# EAGLE design CMD_Light (EAGLE 7.0.0)
Jason Mraz feat. Colbie Caillat - Lucky Birdy - Wings
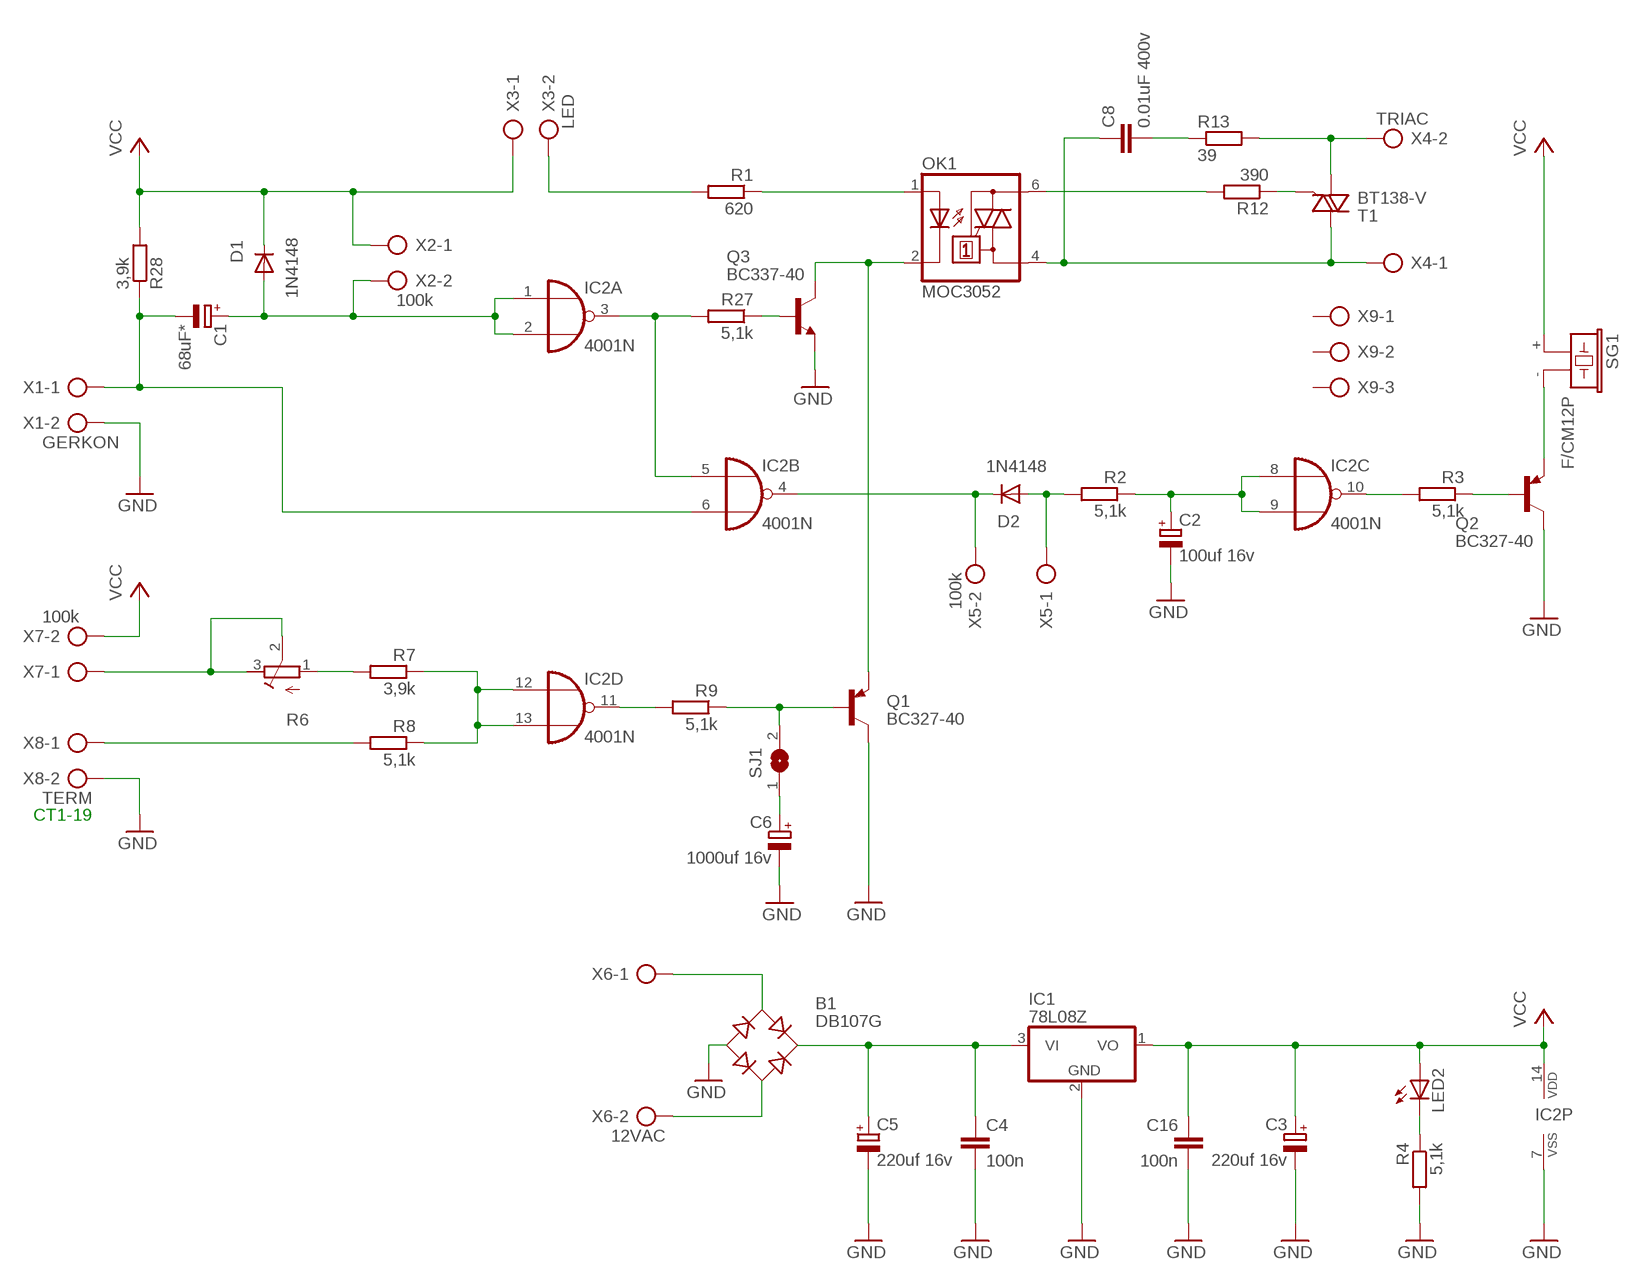
[diagram p0: schematic, sheet 1]

## Parts
B1  DB107G  DBDB107G  [DB]
C1  68uF*  CPOL-EUE3.5-8  [E3,5-8]
C2  100uf 16v  CPOL-EUE3.5-8  [E3,5-8]
C3  220uf 16v  CPOL-EUE3.5-8  [E3,5-8]
C4  100n  C-EU050-035X075  [C050-035X075]
C5  220uf 16v  CPOL-EUE3.5-8  [E3,5-8]
C6  1000uf 16v  CPOL-EUE5-10.5  [E5-10,5]
C8  0.01uF 400v  C-EU075-063X106  [C075-063X106]
C16  100n  C-EU050-035X075  [C050-035X075]
D1  1N4148  1N4004_  [DO41-8]
D2  1N4148  1N4004  [DO41-10]
IC1  78L08Z  [TO92]
IC2  4001N  [DIL14]
LED2  LED3MM  [LED3MM]
OK1  MOC3052  MOC3042M  [DIL06]
Q1  BC327-40  [TO92-EBC]
Q2  BC327-40  [TO92-EBC]
Q3  BC337-40  BC338-40  [TO92-EBC]
R1  620  R-EU_0207/10  [0207/10]
R2  5,1k  R-EU_0207/10  [0207/10]
R3  5,1k  R-EU_0207/10  [0207/10]
R4  5,1k  R-EU_0207/10  [0207/10]
R6  R-TRIMM3339P  [RTRIM3339P]
R7  3,9k  R-EU_0207/10  [0207/10]
R8  5,1k  R-EU_0207/10  [0207/10]
R9  5,1k  R-EU_0207/10  [0207/10]
R12  390  R-EU_0207/10  [0207/10]
R13  39  R-EU_0411/12  [0411/12]
R27  5,1k  R-EU_0207/10  [0207/10]
R28  3,9k  R-EU_0207/12  [0207/12]
SG1  F/CM12P  [F/CM12P]
SJ1  SJ  [SJ]
T1  BT138-V  [TO220BV]
X1  GERKON  AK500/2  [AK500/2]
X2  100k  AK500/2  [AK500/2]
X3  LED  AK500/2  [AK500/2]
X4  TRIAC  AK500/2  [AK500/2]
X5  100k  AK500/2  [AK500/2]
X6  12VAC  AK500/2  [AK500/2]
X7  100k  AK500/2  [AK500/2]
X8  TERM  AK500/2  [AK500/2]
X9  AK500/3  [AK500/3]

## Nets
GND: B1.- C2.- C3.- C4.2 C5.- C6.- C16.2 IC1.2(GND) IC2.7(P:VSS) Q1.C Q2.C Q3.E R4.2 X1.2 X8.2
N$1: Q3.B R27.1
N$2: IC2.3(A:O) IC2.5(B:I0) R27.2
N$3: C1.- IC2.6(B:I1) R28.1 X1.1
N$4: OK1.1(A) R1.1
N$6: OK1.2(C) Q1.E Q3.C
N$7: C6.+ SJ1.1
N$8: R12.1 T1.G
N$9: R1.2 X3.2
N$11: B1.AC2 X6.2
N$12: C2.+ IC2.8(C:I0) IC2.9(C:I1) R2.1
N$13: IC2.10(C:O) R3.2
N$14: Q2.B R3.1
N$15: R13.2 T1.T1(A1) X4.2
N$16: Q2.E SG1.-
N$17: B1.+ C4.1 C5.+ IC1.3(VI)
N$18: D2.A R2.2 X5.1
N$19: C8.2 R13.1
N$20: C1.+ D1.A IC2.1(A:I0) IC2.2(A:I1) X2.2
N$21: IC2.12(D:I0) IC2.13(D:I1) R7.1 R8.1
N$22: LED2.K(C) R4.1
N$23: R6.2(S) R6.3(E) X7.1
N$24: IC2.11(D:O) R9.2
N$27: R6.1(A) R7.2
N$28: R8.2 X8.1
N$34: D2.C IC2.4(B:O) X5.2
N$37: B1.AC1 X6.1
N$38: OK1.6(A2) R12.2
N$39: Q1.B R9.1 SJ1.2
N$41: C8.1 OK1.4(A1) T1.T2(A2) X4.1
VCC: C3.+ C16.1 D1.C IC1.1(VO) IC2.14(P:VDD) LED2.A R28.2 SG1.+ X2.1 X3.1 X7.2
Unconnected: X9.1 X9.2 X9.3

## Notes on the sheet
- CT1-19

## Library data of the parts
B1 = rectifier:DB?*G: Single Phase 1.0 AMP Glass Passivated Bridge Rectifier Taiwan Semiconductor Co.,Ltd. - TSC Source: http://www.taiwansemi.com/TSCbig5/ezcatfiles/cust/img/img/db101g.pdf http://www.ts.com.tw/db/pictures/modules/PDT/PDT060207001/DBLS201G.pdf
C1-C3 C5 C6 = rcl:CPOL-EU: POLARIZED CAPACITOR, European symbol
C4 C8 C16 = rcl:C-EU: CAPACITOR, European symbol
D1 D2 = diode:1N4004: DIODE general purpose rectifier, 1 A
IC1 = linear:78*: Positive VOLTAGE REGULATOR Source: http://cache.national.com/ds/LM/LM78L05.pdf http://www.fairchildsemi.com/ds/LM/LM7805.pdf
IC2 = 40xx:4001: Quad 2-input NOR
LED2 = led:LED: LED OSRAM: - CHIPLED LG R971, LG N971, LY N971, LG Q971, LY Q971, LO R971, LY R971 LH N974, LH R974 LS Q976, LO Q976, LY Q976 LO Q996 - Hyper CHIPLED LW Q18S LB Q993, LB Q99A, LB R99A - SideLED LS A670, LO A670, LY A670, LG A670, LP A670 LB A673, LV A673, LT A673, LW A673 LH A674 LY A675 LS A676, LA A676, LO A676, LY A676, LW A676 LS A679, LY A679, LG A679 - Hyper Micro SIDELED® LS Y876, LA Y876, LO Y876, LY Y876 LT Y87S - SmartLED LW L88C, LW L88S LB L89C, LB L89S, LG L890 LS L89K, LO L89K, LY L89K LS L896, LA L896, LO L896, LY L896 - TOPLED LS T670, LO T670, LY T670, LG T670, LP T670 LSG T670, LSP T670, LSY T670, LOP T670, LYG T670 LG T671, LOG T671, LSG T671 LB T673, LV T673, LT T673, LW T673 LH T674 LS T676, LA T676, LO T676, LY T676, LB T676, LH T676, LSB T676, LW T676 LB T67C, LV T67C, LT T67C, LS T67K, LO T67K, LY T67K, LW E67C LS E67B, LA E67B, LO E67B, LY E67B, LB E67C, LV E67C, LT E67C LW T67C LS T679, LY T679, LG T679 LS T770, LO T770, LY T770, LG T770, LP T770 LB T773, LV T773, LT T773, LW T773 LH T774 LS E675, LA E675, LY E675, LS T675 LS T776, LA T776, LO T776, LY T776, LB T776 LHGB T686 LT T68C, LB T68C - Hyper Mini TOPLED® LB M676 - Mini TOPLED Santana® LG M470 LS M47K, LO M47K, LY M47K Source: http://www.osram.convergy.de LUXEON: - LUMILED® LXK2-PW12-R00, LXK2-PW12-S00, LXK2-PW14-U00, LXK2-PW14-V00 LXK2-PM12-R00, LXK2-PM12-S00, LXK2-PM14-U00 LXK2-PE12-Q00, LXK2-PE12-R00, LXK2-PE12-S00, LXK2-PE14-T00, LXK2-PE14-U00 LXK2-PB12-K00, LXK2-PB12-L00, LXK2-PB12-M00, LXK2-PB14-N00, LXK2-PB14-P00, LXK2-PB14-Q00 LXK2-PR12-L00, LXK2-PR12-M00, LXK2-PR14-Q00, LXK2-PR14-R00 LXK2-PD12-Q00, LXK2-PD12-R00, LXK2-PD12-S00 LXK2-PH12-R00, LXK2-PH12-S00 LXK2-PL12-P00, LXK2-PL12-Q00, LXK2-PL12-R00 Source: www.luxeon.com KINGBRIGHT: KA-3528ASYC Source: www.kingbright.com
OK1 = optocoupler:MOC30*: 6-Pin DIP Zero-Cross Optoisolators Triac Driver Output (250/400 Volt Peak) Source: Data sheet <http://www.fairchildsemi.com/ds/MO/MOC3031M.pdf> The old path of data sheet not more available 2013-05-06.; MF: FAIRCHILD SEMICONDUCTOR; MPN: MOC3042-M; OC_FARNELL: 1021368; OC_NEWARK: 72K8899
Q1 Q2 = transistor-pnp:BC327*: PNP Transistror
Q3 = transistor-npn:BC338*: NPN Transistor
R1-R4 R7-R9 R12 R13 R27 R28 = rcl:R-EU_: RESISTOR, European symbol
R6 = rcl:R-TRIMM: Trimm resistor
SG1 = buzzer:F/CM12P: BUZZER Source: Buerklin; OC_FARNELL: unknown; OC_NEWARK: unknown
SJ1 = jumper:SJ: SMD solder JUMPER
T1 = triac:BT138: TRIAC Source: http://www.semiconductors.philips.com BT138_SERIES_2.pdf
X1-X8 = con-ptr500:AK500/2: CONNECTOR; OC_FARNELL: unknown; OC_NEWARK: unknown
X9 = con-ptr500:AK500/3: CONNECTOR; OC_FARNELL: unknown; OC_NEWARK: unknown

## Board
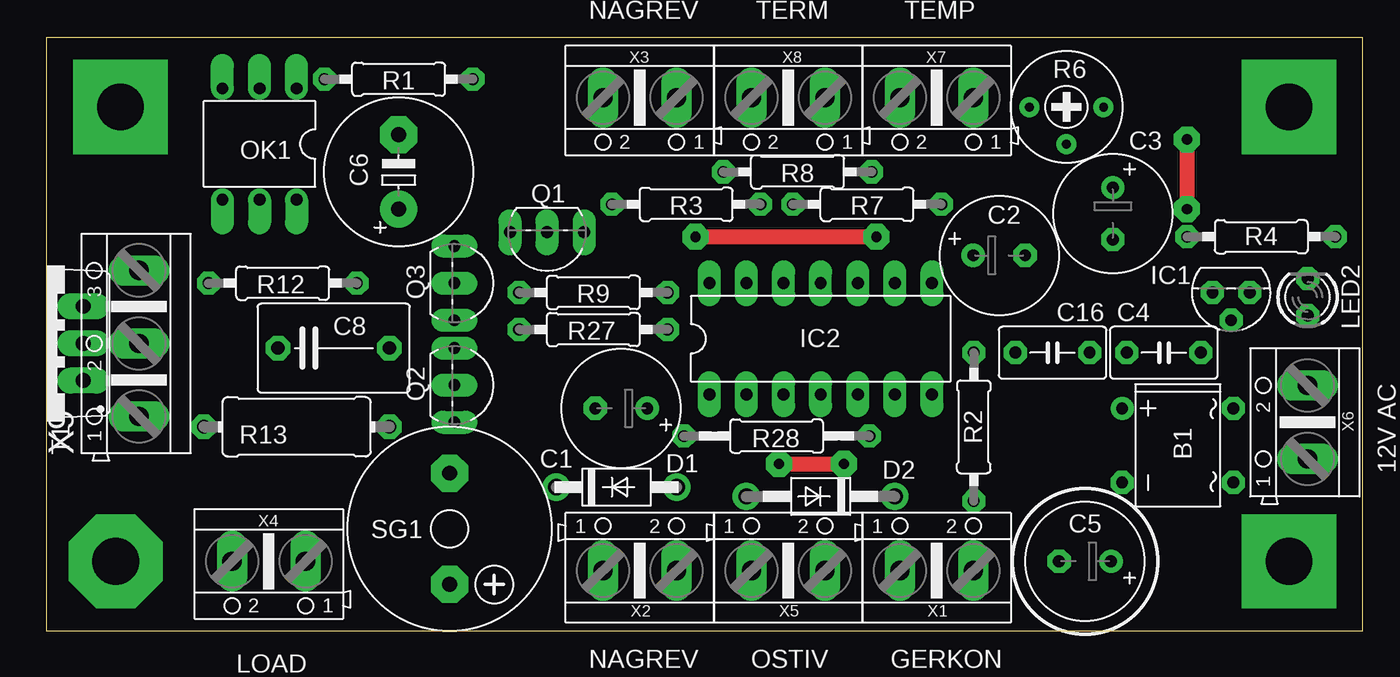
[diagram p1: board, top side]
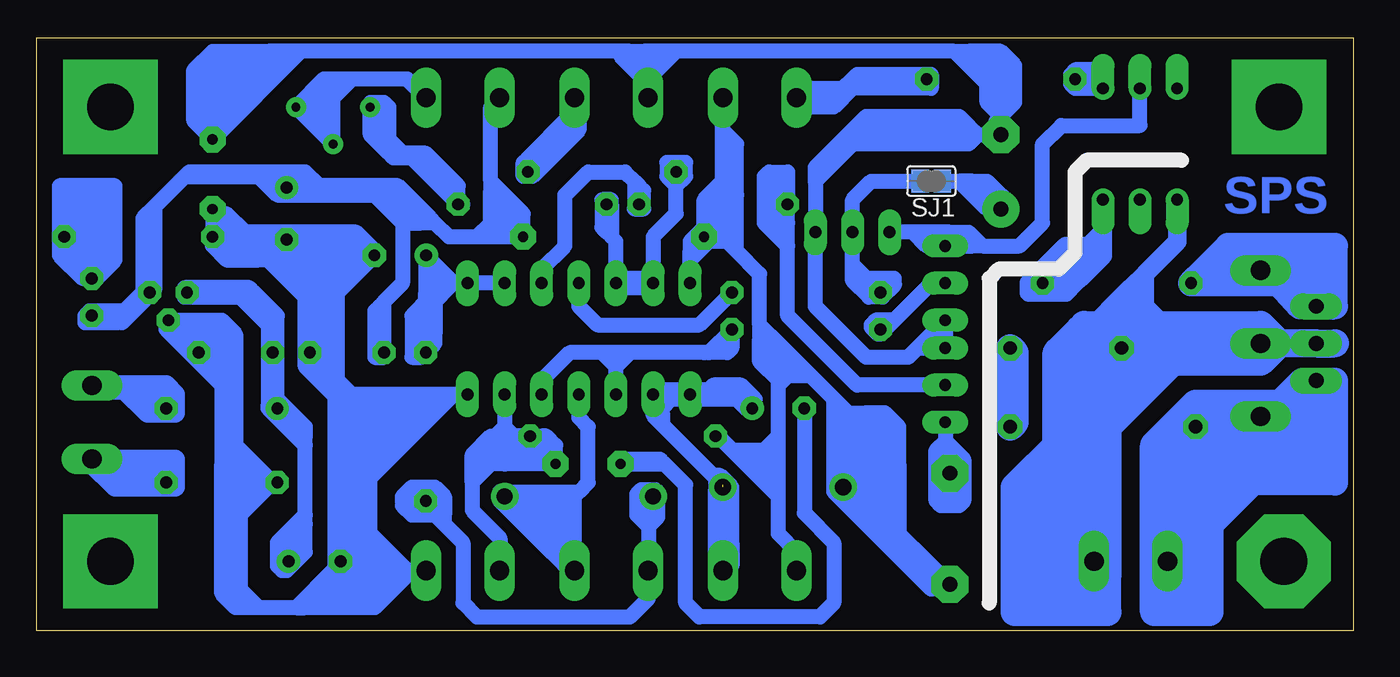
[diagram p2: board, bottom side, seen from below]

Size 90.15 x 40.63 mm. Coordinates in mm from the lower left corner, seen from the top.
Outline: 0,0 90.15,0 90.15,40.63 0,40.63 0,0
Copper layers (1*16): Top 0.035mm / dielectric 1.5mm / Bottom 0.035mm
Design rules "default *": minimum track width 10mil, minimum drill 24mil, track to track 8mil, track to pad 8mil, pad to pad 8mil, via to via 8mil, smd to smd 8mil, copper to edge 40mil, drill to drill 8mil, minimum pad ring 15mil, minimum via ring 8mil, stop-mask expansion 4mil, vias tented up to drill 0mil, thermal gap 10mil
tKeepout: 1 lines

### Footprints (pad centres in the part's own frame; a part is rotated, then mirrored left to right if it is on the bottom)
DB = drill 0.813: + -2.54,-3.81 | drill 0.813 octagon: - 2.54,-3.81; AC1 2.54,3.81; AC2 -2.54,3.81
E3,5-8 = drill 0.813 pad 1.6: + -1.778,0 | drill 0.813 pad 1.6 octagon: - 1.778,0
C050-035X075 = drill 0.813 octagon: 1 -2.54,0; 2 2.54,0
E5-10,5 = drill 1.016 pad 2.54: + -2.54,0 | drill 1.016 pad 2.54 octagon: - 2.54,0
C075-063X106 = drill 0.914 octagon: 1 -3.81,0; 2 3.81,0
DO41-8 = drill 1.118: A 5.08,0; C -3.175,0
DO41-10 = drill 1.118: A 5.08,0; C -5.08,0
TO92 = drill 0.813 octagon: 1 -1.27,0; 2 0,1.905; 3 1.27,0
DIL14 = drill 0.813 long: 1 -7.62,-3.81; 2 -5.08,-3.81; 3 -2.54,-3.81; 4 0,-3.81; 5 2.54,-3.81; 6 5.08,-3.81; 7 7.62,-3.81; 8 7.62,3.81; 9 5.08,3.81; 10 2.54,3.81; 11 0,3.81; 12 -2.54,3.81; 13 -5.08,3.81; 14 -7.62,3.81
LED3MM = drill 0.813 octagon: A -1.27,0; K 1.27,0
DIL06 = drill 0.813 offset: 1 -2.54,-3.81; 2 0,-3.81; 3 2.54,-3.81; 4 2.54,3.81; 5 0,3.81; 6 -2.54,3.81
TO92-EBC = drill 0.813 long: B 0,-1.27; C -2.54,-1.27; E 2.54,-1.27
0207/10 = drill 0.813 octagon: 1 -5.08,0; 2 5.08,0
RTRIM3339P = drill 0.61: 1 -2.54,0; 2 0,-2.54; 3 2.54,0
0411/12 = drill 0.914 octagon: 1 -6.35,0; 2 6.35,0
0207/12 = drill 0.813 octagon: 1 -6.35,0; 2 6.35,0
F/CM12P = drill 1.016 pad 2.54 octagon: + 3.81,0; - -3.81,0
SJ = smd 1.168 x 1.6: 1 -0.762,0; 2 0.762,0
TO220BV = drill 1.016 long: G 2.54,-2.54; T1 -2.54,-2.54; T2 0,-2.54
AK500/2 = drill 1.321 long: 1 -2.515,0; 2 2.515,0
AK500/3 = drill 1.321 long: 1 -5.004,0; 2 0,0; 3 5.004,0

### Placement (x,y rotation side)
B1  77.47,12.7 270 top
C1  39.37,15.24 180 top
C2  65.25,25.72 0 top
C3  73.03,28.57 270 top
C4  76.52,19.05 0 top
C5  71.12,4.76 180 top
C6  24.13,31.43 90 top
C8  19.68,19.37 0 top
C16  68.9,19.05 0 top
D1  38.1,9.84 0 top
D2  53.02,9.21 180 top
IC1  81.12,23.18 180 top
IC2  53.02,20 0 top
LED2  86.36,22.86 90 top
OK1  14.61,33.34 180 top
Q1  34.29,26.04 180 top
Q2  29.21,16.83 270 top
Q3  29.21,23.81 270 top
R1  24.13,37.78 0 top
R2  63.5,13.97 270 top
R3  43.81,29.21 0 top
R4  83.19,26.99 180 top
R6  69.85,35.88 0 top
R7  56.2,29.21 0 top
R8  51.44,31.43 0 top
R9  37.47,23.18 0 top
R12  16.19,23.81 0 top
R13  17.14,13.97 180 top
R27  37.47,20.64 0 top
R28  50.01,13.33 180 top
SG1  27.62,6.99 270 top
SJ1  28.89,30.8 180 bottom
T1  0,19.68 90 top
X1  60.96,4.13 0 top
X2  40.64,4.13 0 top
X3  40.64,36.51 180 top
X4  15.24,4.76 180 top
X5  50.8,4.13 0 top
X6  86.36,14.29 90 top
X7  60.96,36.51 180 top
X8  50.8,36.51 180 top
X9  6.35,19.68 90 top

### Tracks (layer width: path | path; a pad name or v marks a point on that pad's centre or on a via)
GND  (via drill 0.7 pad 1.78)
  Top 1.016: v78.11,33.66 v78.11,28.89
  Bottom 1.016: 26.67,33.97 33.66,33.97 34.29,33.34 | 25.72,33.97 24.45,33.97 | 24.45,33.97 C6.- | 77.47,19.05 77.47,17.46 | 77.47,16.83 77.47,11.43 | 77.47,11.43 76.2,10.16 75.56,10.16 | 75.56,10.16 74.93,10.16 | 74.93,10.16 73.98,10.16 | IC1.2 77.47,21.27 | 77.47,21.27 77.47,19.05 | 77.47,19.05 C4.2 | 72.39,1.59 69.69,4.29 | 69.69,4.29 69.53,4.45 | 69.53,15.88 71.75,18.1 | X8.2 48.28,37.78 | 48.28,37.78 48.28,38.44 49.53,39.69 | 49.53,39.69 72.07,39.69 | 72.07,39.69 v78.11,33.66 | C6.- 24.13,39.05 24.77,39.69 | 24.77,39.69 26.35,39.69 | 27.3,39.69 46.38,39.69 | 46.38,39.69 48.28,37.78 | 64.77,4.13 69.53,4.45 | v78.11,28.89 78.11,28.57 | 78.11,26.35 R4.2 78.11,28.57 | 78.11,26.35 75.25,26.35 | 74.61,26.35 73.03,26.35 | 73.03,26.35 71.75,26.35 | 71.75,26.35 67.31,26.35 | 72.39,1.59 74.93,1.59 | 74.93,1.59 76.2,1.59 | 74.93,1.59 76.2,2.86 | 76.2,2.86 76.52,1.59 | 76.52,1.59 76.52,7.62 73.98,10.16 | 71.75,18.1 C16.2 71.75,26.35 | IC2.7 61.59,16.19 | 61.59,16.19 69.22,16.19 69.53,15.88 | C3.- 73.03,26.35 | 36.83,30.8 Q1.C 36.83,22.23 33.34,18.73 30.48,18.73 29.84,19.37 | Q3.E Q2.C 29.84,19.37 | 69.53,4.45 69.53,4.76 | 69.53,4.76 69.53,15.88 | X1.2 64.77,4.13 | 64.77,4.13 67.31,6.67 67.31,10.48 61.59,16.19 | 46.38,39.69 48.58,39.69 | 49.53,39.69 48.58,39.69 | 48.58,39.69 47.94,39.05 47.94,38.42 48.26,38.1 48.26,37.78 48.58,37.78 50.16,39.37 | C2.- 67.02,26.07 67.31,26.35 | 71.44,21.27 71.44,22.54 75.25,26.35 | 75.25,26.35 74.61,26.35 | 74.61,26.35 74.3,26.04 | 74.3,26.04 73.66,25.4 | 73.66,25.4 72.39,24.13 72.39,25.72 72.71,26.04 73.03,25.72 | 74.3,26.04 74.61,26.04 75.88,27.3 | 78.11,28.57 77.15,28.57 75.88,27.3 | 78.11,26.35 77.15,25.4 74.93,25.4 | 73.66,25.4 74.93,25.4
  Bottom 1.016: 74.93,25.4 77.47,27.94 77.47,26.99 | 77.47,16.83 77.47,17.46 | 77.47,17.46 C4.2 | C4.2 IC1.2 | IC1.2 80.01,21.27 78.74,20 78.74,20.32 78.42,20.64 78.42,20.32 78.11,20 78.11,20.64 77.47,21.27 | 77.47,21.27 76.52,20.32 76.52,12.7 | 76.52,11.75 76.52,11.11 75.56,10.16 | 76.52,1.59 77.47,2.54 77.47,11.43 | B1.- 73.98,10.16 | 75.25,11.43 76.52,12.7 | 76.52,12.7 76.52,11.75 | 76.52,11.75 75.25,10.48 | 75.88,11.43 75.25,11.43 | 75.25,11.43 73.98,10.16 | 74.93,10.16 74.93,9.84 76.2,8.26 76.2,2.86 | 63.82,3.81 64.77,3.81 66.99,1.59 71.75,1.59 | 72.39,1.59 71.75,1.59 | 71.75,1.59 69.85,3.49 65.72,3.49 65.41,3.81 65.72,3.81 67.31,2.22 70.48,2.22 | 70.8,2.22 70.48,2.22 | 70.48,2.22 69.85,2.86 67.31,2.86 | 29.84,19.37 28.26,20.95 28.26,19.68 | 36.83,30.8 36.83,31.75 33.34,35.24 26.99,35.24 26.35,34.61 | 25.72,33.97 26.67,33.97 | 26.67,33.97 27.3,34.61 | 27.3,34.61 33.34,34.61 | 27.3,34.61 26.35,34.61 | 26.35,34.61 25.72,33.97 | 25.72,33.97 26.35,33.34 34.29,33.34 | 34.29,33.34 36.83,30.8 | C6.- 24.13,35.24 25.08,36.2 25.08,37.46 27.3,39.69 | 27.3,39.69 26.35,39.69 | 26.35,39.69 25.4,38.73 25.08,38.73 24.45,38.1 | 24.45,33.97 24.45,34.93 23.18,36.2 23.18,38.73 24.13,39.69 24.77,39.69 | 78.42,33.97 79.38,34.93 79.38,35.88 | 79.38,35.88 79.38,38.42 78.11,39.69 74.93,39.69 | 74.93,39.69 74.3,39.69 | 73.03,39.69 77.79,34.93 78.42,35.56 78.42,38.42 77.79,39.05 75.56,39.05 74.93,39.69 | 73.03,39.69 74.3,39.69 | 74.3,39.69 78.11,35.88 78.11,37.15 | 78.11,37.15 78.11,37.46 76.83,38.73 76.52,38.73 | 75.88,38.73 76.52,38.73 | 76.52,38.73 78.11,37.15 | 79.38,35.88 78.11,34.61 | 76.2,2.86 76.2,1.59 | 76.2,1.59 76.52,1.59 | 67.31,15.88 68.26,15.88 69.53,17.14 69.53,23.18 66.99,25.72 67.31,25.72
  Bottom 1.016: 67.31,25.72 67.63,25.72 69.85,23.5 69.85,24.13 68.26,25.72 69.53,25.72 69.85,26.04 69.85,17.46 70.17,17.14 70.17,18.1 70.48,18.1 70.8,18.41 70.8,25.72 | 67.31,25.72 67.31,26.35 | 67.31,26.35 68.26,27.3 75.88,27.3 | IC1.2 81.28,20.64 77.47,16.83 | 69.22,2.54 69.22,3.17 69.85,3.81 69.53,4.13 69.69,4.29 | 69.69,4.29 69.69,16.67 69.85,16.83 | 74.93,10.16 77.15,7.94 77.15,9.84 76.83,10.16 76.52,10.16 76.2,9.84 76.83,9.21 | C5.- 69.53,4.76 | 72.07,39.69 73.03,39.69 | 71.75,18.1 71.75,23.5
N$1
  Bottom 1.016: R27.1 32.07,20.64 31.43,21.27 | 31.43,21.27 31.11,21.59 28.89,23.81 Q3.B | 31.43,21.27 32.7,21.27 33.02,20.95 33.02,20.8 32.54,20.32 32.38,20.32 31.43,21.27
N$2
  Bottom 1.016: 44.13,19.05 44.45,19.05 49.53,19.05 | 49.53,19.05 50.48,19.05 | 51.44,19.05 53.66,19.05 55.56,17.14 IC2.5 | 50.48,18.1 50.48,19.05 | 44.13,19.05 R27.2 42.55,19.37 42.86,19.05 44.13,19.05 | IC2.3 50.48,18.1 | 50.48,18.1 49.53,19.05 | 50.48,19.05 51.44,19.05 | 51.44,19.05 50.48,18.1
N$3  (via drill 0.7 pad 1.78)
  Top 1.016: v50.16,11.43 v54.61,11.43
  Bottom 1.016: IC2.6 58.1,13.97 | 58.1,13.97 58.1,13.33 | 55.56,13.33 R28.1 58.1,13.33 | 58.1,13.33 60.33,11.43 | 60.33,10.16 60.33,8.26 58.42,6.35 58.42,4.15 X1.1 | C1.- 37.59,8.06 35.56,6.03 35.56,1.91 36.51,0.95 44.77,0.95 45.72,1.91 45.72,10 47.15,11.43 | 47.15,11.43 47.31,11.59 | 47.31,11.59 v50.16,11.43 | 58.1,11.43 v54.61,11.43 54.61,12.7 55.24,13.33 55.56,13.33 | 58.1,11.43 58.1,12.38 | 58.1,12.38 58.1,13.33 | 47.31,11.59 47.47,11.75 50.16,11.75 v50.16,11.43 | 50.16,11.11 v50.16,11.43 | v50.16,11.43 47.15,11.43 | 55.56,13.33 55.56,12.06 57.47,12.06 58.1,11.43 | 58.1,11.43 59.05,11.43 | 59.05,11.43 60.33,10.16 | 60.33,10.16 60.33,11.43 | 60.33,11.43 60.33,11.75 | 60.33,11.75 59.37,12.7 58.74,12.7 60.01,11.43 59.05,11.43 | 59.05,11.43 58.1,12.38 | 58.1,12.38 56.2,12.38 55.88,12.7 | 60.33,11.75 60.33,12.06 59.05,13.33 58.74,13.33 | 58.74,13.33 58.1,13.33 | 56.52,12.7 56.83,12.7 58.1,13.97 | 58.1,13.97 58.74,13.33
N$4
  Bottom 1.016: 17.46,37.78 OK1.1 19.05,37.15 19.37,37.46 19.37,38.1 19.05,38.42 17.14,38.42 17.46,37.78 | 17.46,37.78 R1.1
N$6
  Bottom 1.016: OK1.2 14.61,34.61 20,34.61 21.27,33.34 21.27,27.94 22.86,26.35 25.4,26.35 | 26.67,26.35 Q3.C 29.21,26.35 30.16,27.3 | 26.67,26.35 26.04,26.35 | 30.16,27.3 Q1.E | 26.67,26.35 27.62,27.3 | 27.62,27.3 30.16,27.3 | 27.62,27.3 26.35,27.3 25.4,26.35 | 25.4,26.35 26.04,26.35 | 26.04,26.35 26.67,26.99
N$7
  Bottom 1.016: SJ1.1 26.99,30.8 | 26.04,30.8 C6.+ | 26.04,30.8 25.08,30.8 24.77,30.48 | 23.5,28.89 23.5,29.21 24.77,30.48 | 24.77,30.48 24.77,29.53 C6.+ | C6.+ 25.08,28.89 26.04,29.84 | 26.04,29.84 26.04,30.8 | 26.04,30.8 26.99,30.8 | 26.99,30.8 26.04,29.84
N$8
  Bottom 1.778: 10.79,24.13 8.57,26.35 1.27,26.35 1.27,22.23 T1.G 3.65,22.23 5.4,24.13 10.79,24.13 | 10.79,24.13 R12.1 2.22,23.81 | 1.91,25.4 8.89,25.4
  Bottom 1.93: 6.03,24.77 5.4,24.13 | 2.22,23.81 2.22,25.08 1.91,25.4 | 8.89,25.4 9.21,25.08
N$9
  Bottom 1.016: X3.2 35.56,36.51 35.24,36.83 | 34.29,37.78 R1.2 28.89,38.1 | 28.89,38.1 28.89,37.15 34.29,37.15 | 34.92,37.15 35.24,36.83 | 34.29,37.78 33.97,38.1 28.89,38.1 | 34.29,37.78 34.92,37.15 | 35.24,36.83 38.1,36.83 38.1,37.15 | 38.1,37.15 34.92,37.15 | 34.92,37.15 34.29,37.15 | 34.29,37.15 35.56,35.88 38.1,35.88 | 38.42,35.88 38.42,36.83 38.1,37.15
N$10
  Bottom 1.016: 65.72,4.45 66.36,4.45 67.63,5.72 67.63,11.11 63.18,15.56 64.45,15.56 67.31,12.7 67.31,13.97 65.41,15.88 66.67,15.88 67.31,15.24
N$11
  Bottom 1.27: B1.AC2 82.87,16.83 83.82,16.83 | 84.45,16.83 86.33,16.83
  Bottom 1.346: 86.36,16.83 84.45,16.83 | 84.45,16.83 83.82,16.83 | 84.14,16.51 82.55,14.92 80.64,14.92 80.64,16.19 81.28,16.83 82.23,16.83 83.82,16.83 | 84.14,16.51 84.45,16.83 | 83.82,16.83 84.14,16.51 | 84.14,16.51 86.36,16.51
  Bottom 1.778: 86.33,16.83 X6.2
N$12
  Bottom 1.016: IC2.9 IC2.8 61.59,23.81 | C2.+ 62.23,24.45 62.23,23.81 | 62.23,23.81 61.59,23.81 | R2.1 64.14,21.91 | 64.14,21.91 63.5,22.54 | 63.5,22.54 62.23,23.81 | 63.5,25.72 63.5,23.18 | 63.5,22.54 63.5,23.18 | 63.5,23.18 62.87,23.81 | 62.87,23.81 62.55,24.13 62.55,24.77 61.59,23.81 | 62.87,23.81 62.87,20.32 | 62.87,20.32 R2.1 | R2.1 64.14,19.37 63.18,20.32 63.18,22.23 61.59,23.81 | 64.14,21.91 64.45,21.59 64.45,18.73 63.82,18.73 62.87,19.68 62.87,20.32
N$13
  Bottom 1.016: IC2.10 55.56,24.77 53.98,26.35 53.98,29.84 52.39,31.43 49.85,31.43 49.21,30.8 | 49.21,30.8 48.9,30.48 | 48.9,30.48 R3.2 49.21,28.89 | 49.21,28.89 48.58,28.89 48.58,30.16 48.9,30.48 | 49.21,30.8 49.21,28.89
N$14
  Bottom 1.016: Q2.B 33.97,16.83 38.73,21.59 38.73,26.35 | 38.73,26.35 38.73,27.94 | 38.73,27.94 R3.1 38.73,31.43 40.01,31.43 40.32,31.11 40.32,27.94 38.73,26.35 | 38.73,27.94 39.05,27.62 39.05,28.26 39.69,28.89 39.69,30.48 39.37,30.8 39.37,27.94 39.69,27.62
N$15
  Bottom 1.778: 5.08,15.56 3.49,17.14 T1.T1 1.27,17.14 1.27,10.16 6.99,10.16
  Bottom 1.93: X4.2 12.72,1.3 12.7,1.27 13.65,1.27 13.65,1.59 | 13.65,1.59 13.65,12.7 11.43,14.92 | 11.43,14.92 10.79,15.56 5.08,15.56 | 6.99,10.16 9.84,7.3 9.84,1.27 13.34,1.27 13.65,1.59 | R13.2 10.79,14.29 11.43,14.92
N$16
  Bottom 1.016: 27.94,13.02 SG1.- | Q2.E 27.94,13.02 | 27.94,13.02 26.67,11.75 26.67,8.89 26.99,8.57 28.26,8.57 28.57,8.89 28.57,12.38 27.94,13.02
N$17
  Bottom 1.016: 73.98,21.91 75.25,23.18 | 75.25,23.18 76.52,23.18 | 76.52,23.18 IC1.3 | 71.75,7.3 71.75,7.94 | 71.75,7.94 71.75,12.7 | 71.75,12.7 71.75,13.33 | 71.75,13.33 B1.+ 73.98,15.56 C4.1 73.98,21.91 | 71.75,7.3 73.66,6.03 | 73.66,6.03 72.39,5.72 C5.+ | 75.25,23.18 75.56,23.5 80.01,23.5 80.01,22.86 75.09,22.86 74.3,22.07 74.3,20.95 | 74.3,20.95 74.3,15.4 | 74.3,15.4 73.82,14.92 73.18,14.92 73.18,15.4 | 73.18,15.4 73.66,15.88 73.66,21.59 73.98,21.91 | 73.18,15.4 71.75,13.97 71.75,13.33 | 74.3,15.4 74.3,15.24 71.75,12.7 | 72.07,6.03 71.75,7.94 | 71.75,7.94 73.66,6.03 | 73.66,6.03 73.66,4.45 73.34,4.13 73.03,4.13 71.75,5.4 71.75,7.3 | 74.3,20.95 76.52,23.18
N$18
  Bottom 1.016: 48.26,9.52 48.1,9.52 47.94,9.68 | 47.94,9.68 47.78,9.68 47.62,9.52 47.62,7.78 48.26,7.14 | 48.26,7.14 48.26,9.21 D2.A | 48.26,7.14 48.26,4.15 X5.1 48.26,4.1 48.26,2.22 49.53,0.95 60.01,0.95 60.96,1.91 60.96,6.03 62.23,7.3 | R2.2 63.5,8.57 | 63.5,8.57 62.87,7.94 | 62.87,7.94 62.23,7.3 | 48.26,7.14 49.05,7.94 49.05,9.37 48.74,9.68 47.94,9.68 | 63.5,8.57 64.14,9.21 64.77,9.21 65.09,8.89 | 65.09,8.89 65.09,8.57 64.45,7.94 62.87,7.94 | 64.77,8.57 65.09,8.89 | 65.09,8.89 65.09,9.21 64.45,9.84 62.87,9.84 62.23,9.21 62.23,7.94 | 62.23,7.3 62.23,7.94 | 62.23,7.94 63.5,9.21
N$19
  Bottom 1.93: R13.1 C8.2 23.18,19.05 23.18,14.29 R13.1
N$20  (1 unrouted)
  Bottom 1.016: 43.81,16.51 47.94,16.51 47.94,15.56 47.31,14.92 | 41.27,15.24 40.96,15.24 40.96,15.88 41.91,16.83 43.81,16.83 44.45,16.19 | 46.67,16.19 IC2.1 44.45,16.19 | 46.67,16.19 IC2.2 47.94,14.76 43.18,10 43.18,8.89 | C1.+ 41.47,15.11 42.55,16.19 44.45,16.19 | X2.2 43.16,5.42 | 43.16,5.42 42.55,6.03 | 43.18,5.4 43.18,6.67 | 43.18,4.13 43.18,5.4 | 43.18,5.4 43.16,5.42 | 42.55,6.03 42.55,9.84 43.34,10.64 43.66,10.64 43.66,9.37 43.18,8.89 | 43.18,8.89 43.18,6.67 | 43.18,6.67 42.55,6.03 | 42.55,6.03 42.55,4.45 42.86,4.13 | 46.67,16.19 47.31,15.56 47.31,15.24 | 47.31,14.92 47.31,14.29 | 47.31,14.92 47.31,15.24 | 47.31,15.24 46.67,15.88 41.27,15.88
N$21
  Bottom 1.016: IC2.12 50.48,24.13 | 50.48,24.13 50.48,26.67 50.8,26.99 | 50.8,26.99 51.12,27.3 | 51.12,27.3 R7.1 50.8,29.21 | 50.8,29.21 50.8,26.99 | 50.8,29.21 50.8,29.53 51.44,29.53 51.44,27.62 51.12,27.3 | R8.1 46.35,30.48 | 46.35,30.48 46.35,28.57 47.94,26.99 IC2.13 48.26,23.81 | 46.35,30.48 45.72,31.11 45.72,32.07 46.99,32.07 46.99,31.11 46.35,30.48 | 48.26,23.81 IC2.12 | 48.26,24.45 48.26,24.13 | 48.26,23.81 48.26,24.13 | 48.26,24.13 50.48,24.13 | IC2.12 50.48,23.5 47.94,23.5
N$22
  Bottom 1.016: R4.1 86.36,26.99 LED2.K | LED2.K 86.04,24.13 84.77,25.4 84.77,30.48 88.58,30.48 88.58,25.72 87,24.13 LED2.K | LED2.K 86.36,24.45 88.27,26.35 88.27,29.84 85.72,29.84 85.72,25.72 86.04,25.4 86.36,25.4 87.63,26.67 87.63,29.21 86.36,29.21 86.36,27.3 87,27.3 87,28.57
N$23
  Bottom 1.016: X7.1 63.5,36.51 64.77,37.78 68.58,37.78 | 69.53,37.78 70.48,37.78 R6.3 R6.2 69.85,36.51 68.58,37.78 | 68.58,37.78 69.53,37.78 | 69.53,37.78 71.44,35.88 70.48,34.93 70.48,36.2
N$24
  Bottom 1.016: IC2.11 53.02,22.23 51.75,20.95 44.77,20.95 R9.2
N$25
  Bottom 1.93: 13.02,20.32 13.02,20 18.1,14.92 18.1,2.54 21.91,2.54 21.91,9.52 19.05,12.38 19.05,3.81 19.37,3.49 19.68,3.49 20.32,4.13 20.32,10.16 19.68,10.8 19.68,14.61 19.05,15.24 19.05,17.78 17.46,19.37 15.88,19.37 | 15.56,19.37 15.88,19.37 | 15.88,19.37 18.73,16.51
N$27
  Bottom 1.016: R7.2 61.28,30.48 63.5,32.7 64.77,32.7 | 64.77,32.7 65.09,32.7 | 65.09,32.7 66.04,32.7 | 66.04,32.7 66.67,33.34 67.31,33.97 R6.1 67.31,36.2 66.36,36.2 66.04,35.88 66.04,33.34 | 66.04,32.7 66.04,33.34 | 66.04,33.34 66.67,33.97 66.67,34.29 | 66.67,35.56 66.67,34.29 | 66.67,34.29 65.09,32.7 | 60.96,29.21 R7.2 | R7.2 64.77,32.7 | 64.14,32.38 65.72,32.38 66.04,32.7
N$28
  Bottom 1.016: X8.1 53.34,36.49 53.34,34.61 R8.2 56.83,31.43 | 56.83,31.43 56.83,32.07 56.52,32.38 53.66,35.24 53.02,35.24 53.02,34.29 56.2,31.11 56.83,31.11 56.83,31.43
N$29  (via drill 3.2 pad 6.45)
  other vias: 4.76,4.76
N$30
  Bottom 1.016: 35.24,14.92 34.61,14.29 34.61,9.21 33.97,8.57 33.97,10.8 | 33.97,13.33 33.97,10.8 | 33.97,10.8 32.38,9.21 32.38,8.26
N$31  (via drill 3.2 pad 6.45)
  other vias: 5.08,35.88
N$32  (via drill 3.2 pad 6.45)
  other vias: 85.09,35.88
N$33  (via drill 3.2 pad 6.45)
  other vias: 85.09,4.76
N$34
  Bottom 1.016: 53.34,5.4 54.93,5.4 | 54.93,5.4 56.2,6.67 58.42,8.89 58.42,9.52 53.02,9.52 | 53.02,9.52 52.39,10.16 52.39,13.97 53.02,14.61 IC2.4 | 53.02,9.52 53.34,9.21 | 53.34,9.21 D2.C | X5.2 53.31,9.18 53.34,9.21 | 53.34,9.21 54.29,8.26 54.29,6.35 53.98,6.03 54.29,6.03 57.15,8.89 54.93,8.89 54.61,8.57 55.88,8.57 | 56.2,8.57 55.88,8.57 | 55.88,8.57 54.61,7.3 | 54.93,5.4 53.34,3.81
N$35
  Bottom 1.93: 12.38,1.91 11.11,1.91 11.11,5.4 12.38,6.67 12.38,11.75 10.16,13.97 4.45,13.97 2.54,15.88 2.54,12.06 1.91,11.43 7.3,11.43 11.11,7.62 | 11.11,7.62 11.11,6.35 | 11.11,7.62 11.11,10.8 9.21,12.7 7.3,12.7 | 3.81,12.7 7.3,12.7 | 7.3,12.7 10.48,9.52
N$36
  Bottom 1.016: 26.99,11.75 26.99,9.21 28.26,9.21 28.57,8.89 28.57,11.75
N$37
  Bottom 1.27: B1.AC1 85.09,10.16 86.36,11.43 X6.1
  Bottom 1.346: 86.04,11.75 80.64,11.75 80.64,9.84 84.77,9.84 86.36,11.43 82.23,11.43 81.28,10.48
N$38
  Bottom 1.27: OK1.6 17.14,27.3 | 17.14,26.67 17.14,25.72 18.73,24.13 | 18.73,24.13 19.05,23.81 | 19.05,23.81 R12.2 | 19.05,24.13 18.73,24.13 | 19.05,23.81 19.68,23.18 22.23,23.18 22.23,23.81 19.68,26.35 18.1,26.35 17.14,27.3 | 17.14,27.3 17.14,26.67 | 17.14,26.67 18.73,25.08 19.05,25.08 20,24.13 20,24.77 19.05,25.72
N$39
  Bottom 1.016: SJ1.2 33.02,30.8 34.29,29.53 Q1.B 34.29,25.08 | 34.29,24.45 33.02,23.18 R9.1 32.07,23.18 31.43,23.81 | 34.29,24.45 34.29,25.08 | 31.43,23.81 31.43,24.13 31.75,24.13 | 31.75,24.13 33.34,24.13 34.29,25.08 | 31.75,24.13 31.43,23.81 | 31.43,23.81 31.43,23.65 32.23,22.86 33.18,22.86 34.29,23.97 34.29,24.45
N$40
  Bottom 1.016: 43.5,13.33 42.55,12.38 39.69,12.38 39.69,10.48 | 39.69,10.16 39.69,10.48 | 39.69,10.48 40.96,11.75
N$41
  Bottom 1.27: C8.1 15.88,22.86 | 15.88,22.86 15.24,23.5 | 15.24,23.5 14.29,24.45 | 14.29,24.45 12.06,26.67 OK1.4 | 18.41,20.95 17.78,20.95 15.88,22.86 | 15.24,23.5 15.24,23.18 12.7,20.64 13.97,20.64 15.56,22.23 14.92,22.23 14.29,21.59 14.29,24.45
  Bottom 1.93: 20.95,10.8 20.32,11.43 20.32,19.05 20,19.37 | 1.27,19.68 T1.T2 5.08,19.68 | 5.08,19.68 6.35,18.41 12.38,18.41 16.83,13.97 16.83,3.84 | 20,19.37 20,13.02 23.18,9.84 23.18,1.27 16.83,1.27 16.83,3.84 | 20,19.37 18.73,20.64 18.41,20.95 6.35,20.95 5.08,19.68 | 5.08,19.68 15.56,19.68 C8.1 | 16.83,3.84 X4.1
N$42
  Bottom 1.016: 43.5,3.81 43.5,4.29 43.66,4.45 43.66,9.68
VCC  (via drill 0.7 pad 1.78)
  Top 1.016: v44.45,26.99 v56.83,26.99
  Bottom 0.406: 31.75,6.67 32.7,7.62
  Bottom 1.016: IC2.14 45.4,25.4 | 45.4,25.4 45.4,25.72 45.4,26.04 | v44.45,26.99 43.18,26.99 | 43.18,26.99 43.18,29.84 | 43.18,30.8 43.18,34 X3.1 | 40.64,20.95 40.64,24.45 42.23,26.04 | 42.23,26.04 43.18,26.99 | 80.01,31.11 82.07,29.05 | 82.07,29.05 82.07,23.34 | 82.07,23.34 IC1.1 84.14,21.59 | 65.09,28.26 63.18,28.26 | 63.18,28.26 62.87,27.94 | 62.87,27.94 61.91,26.99 60.01,26.99 | 60.01,26.99 v56.83,26.99 56.83,28.57 59.05,30.8 | 59.05,30.8 59.05,35.88 58.42,36.49 X7.2 | 65.09,28.26 66.67,30.16 72.83,30.16 C3.+ 73.22,30.35 74.3,31.43 | 65.09,28.26 65.09,27.94 | 65.09,27.94 65.09,23.81 66.36,22.54 | C16.1 66.67,22.23 | 66.67,22.23 66.36,22.54 | 84.14,21.59 LED2.A | 32.07,9.52 32.38,9.84 | 32.38,9.84 32.38,12.7 | 32.38,12.7 33.34,13.65 | 33.34,13.65 37.15,17.46 | 37.15,17.46 39.21,19.53 | 39.21,19.53 40.64,20.95 | SG1.+ 28.89,2.86 | 28.89,2.86 31.11,5.08 | 31.11,5.08 31.75,5.72 | 31.75,5.72 33.34,7.3 | 39.37,9.21 43.5,13.33 R28.2 | 39.37,9.21 39.37,13.33 | 39.37,13.33 39.37,16.83 | 39.37,17.14 39.37,17.46 | 39.37,17.46 39.37,19.37 39.21,19.53 | 31.75,12.06 31.11,11.43 | 31.11,11.43 31.11,6.03 | 31.11,6.03 31.11,5.08 | 31.11,5.08 28.89,3.17 | 28.89,2.86 28.89,3.17 | 28.89,3.17 31.75,5.72 | 31.75,5.72 31.75,6.67 31.75,12.06 | 31.75,12.06 32.38,12.7 | 33.34,13.65 33.34,7.3 | SG1.+ 31.11,6.03 | 45.4,26.04 v44.45,26.99 | v44.45,26.99 44.45,29.53 43.18,30.8 | 43.18,30.8 43.18,29.84 | 43.18,29.84 43.5,29.53 43.5,27.94 | 43.5,27.94 43.81,27.62 | 42.23,26.04 42.23,29.84 | 42.23,29.84 43.18,30.8 | 42.55,27.94 42.55,29.53 42.23,29.84 | 42.23,29.84 42.23,33.34 43.18,34.29 | 42.55,26.67 44.13,26.67 45.4,25.4 | 37.15,17.46 38.1,17.46 | 38.73,17.46 39.37,17.46 | 39.37,17.46 38.73,18.1 38.73,17.78 38.1,17.46
  Bottom 1.016: 38.1,17.46 38.73,17.46 | 38.73,17.46 39.37,16.83 | X2.1 38.12,5.42 39.37,6.67 39.37,9.21 | 32.38,9.84 D1.C | SG1.+ 32.7,8.26 33.34,7.3 | 33.34,7.3 35.56,9.52 35.56,15.88 | 31.43,10.16 31.43,11.11 31.11,11.43 | 31.11,11.43 31.11,13.97 32.07,14.92 33.34,14.92 | 34.92,14.92 33.34,14.92 | 33.34,14.92 31.43,13.02 | 39.37,13.33 40.64,12.06 40.01,11.43 | 84.3,21.11 82.07,23.34 | 82.07,29.05 82.87,28.26 82.87,23.18 84.14,21.91 86.52,21.91 86.84,21.59 86.84,21.11 84.61,21.11 | 84.61,21.11 84.14,21.59 | 63.18,28.26 65.41,30.48 70.8,30.48 71.75,31.43 | 71.75,31.43 74.3,31.43 | 74.3,31.43 79.69,31.43 80.01,31.11 | 80.01,31.11 74.93,31.11 | 74.93,31.11 72.07,31.11 71.75,30.8 71.75,31.43 | 74.93,31.11 73.66,29.84 66.99,29.84 65.09,27.94 | 65.09,27.94 63.82,27.94 | 62.87,27.94 63.82,27.94 | 63.82,27.94 66.04,30.16 | 60.01,26.99 59.05,27.94 59.05,30.16 | 59.05,30.8 59.05,30.16 | 59.05,30.16 57.47,28.57 57.47,27.3 58.42,27.3 58.74,27.62 58.74,28.57 58.42,28.57 58.1,28.26 | C16.1 66.36,18.73 66.99,18.73 66.99,21.91 66.67,22.23 | C16.1 66.36,22.54 | 84.77,21.27 84.45,21.27 84.3,21.11 | 84.3,21.11 84.61,21.11 | 39.37,16.83 39.37,17.14 | 39.37,17.14 40.64,18.41 40.64,20 | 40.64,20.95 40.64,20 | 40.64,20 40.01,19.37 40.01,18.41 | 43.5,27.94 44.13,27.94 45.4,26.67 45.4,26.04
(copper drawn outside any net)
  shapes: Bottom area x1

### Text on the board
Bottom: SPS
tPlace: LED | 47k | NAGREV | TERM | TEMP | 12V AC | LOAD | NAGREV | OSTIV | GERKON | 100k | 100k